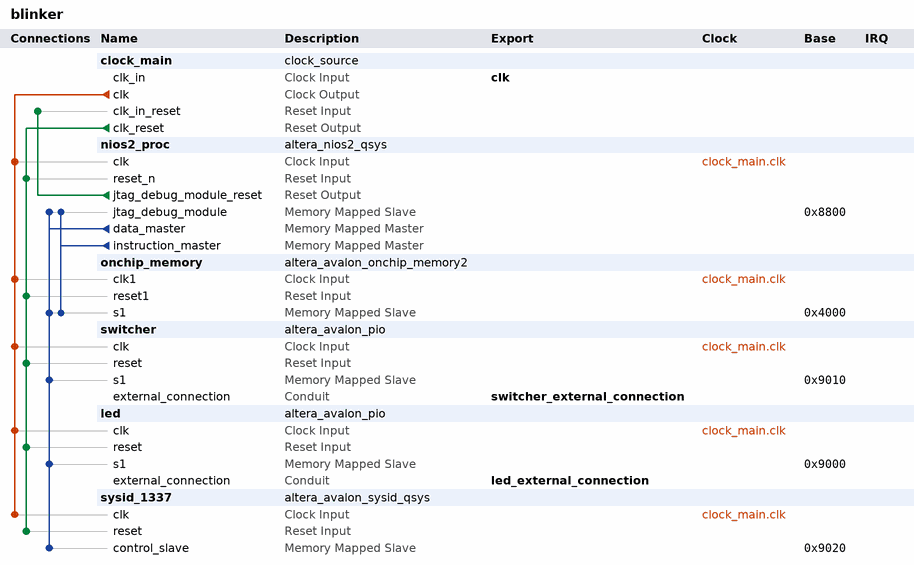
[diagram p0: system contents]
# Platform Designer (Qsys) system blinker, Cyclone IV GX Unknown
# Parameters at their usual value, and those the tool derives, are not listed.
package require -exact qsys 13.0
create_system blinker
set_project_property DEVICE_FAMILY {Cyclone IV GX}
set_project_property DEVICE Unknown

add_instance clock_main clock_source 13.0
set_instance_parameter_value clock_main clockFrequency 50000000

add_instance nios2_proc altera_nios2_qsys 13.0
set_instance_parameter_value nios2_proc resetSlave onchip_memory.s1
set_instance_parameter_value nios2_proc mmu_TLBMissExcSlave None
set_instance_parameter_value nios2_proc exceptionSlave onchip_memory.s1
set_instance_parameter_value nios2_proc breakSlave nios2_proc.jtag_debug_module
set_instance_parameter_value nios2_proc impl Tiny
set_instance_parameter_value nios2_proc icache_size 4096

add_instance onchip_memory altera_avalon_onchip_memory2 13.0.1.99.2
set_instance_parameter_value onchip_memory dataWidth 32
set_instance_parameter_value onchip_memory dualPort false
set_instance_parameter_value onchip_memory initMemContent true
set_instance_parameter_value onchip_memory initializationFileName onchip_mem.hex
set_instance_parameter_value onchip_memory memorySize 16384

add_instance switcher altera_avalon_pio 13.0.1.99.2
set_instance_parameter_value switcher direction Input
set_instance_parameter_value switcher width 8

add_instance led altera_avalon_pio 13.0.1.99.2
set_instance_parameter_value led direction Output
set_instance_parameter_value led width 8

add_instance sysid_1337 altera_avalon_sysid_qsys 13.0
set_instance_parameter_value sysid_1337 id 4919

# connections
add_connection clock_main.clk led.clk clock
add_connection clock_main.clk nios2_proc.clk clock
add_connection clock_main.clk onchip_memory.clk1 clock
add_connection clock_main.clk switcher.clk clock
add_connection clock_main.clk sysid_1337.clk clock
add_connection clock_main.clk_reset led.reset reset
add_connection clock_main.clk_reset nios2_proc.reset_n reset
add_connection clock_main.clk_reset onchip_memory.reset1 reset
add_connection clock_main.clk_reset switcher.reset reset
add_connection clock_main.clk_reset sysid_1337.reset reset
add_connection nios2_proc.jtag_debug_module_reset clock_main.clk_in_reset reset
add_connection nios2_proc.data_master led.s1 avalon
set_connection_parameter_value nios2_proc.data_master/led.s1 baseAddress 0x9000
add_connection nios2_proc.data_master nios2_proc.jtag_debug_module avalon
set_connection_parameter_value nios2_proc.data_master/nios2_proc.jtag_debug_module baseAddress 0x8800
add_connection nios2_proc.data_master onchip_memory.s1 avalon
set_connection_parameter_value nios2_proc.data_master/onchip_memory.s1 baseAddress 0x4000
add_connection nios2_proc.data_master switcher.s1 avalon
set_connection_parameter_value nios2_proc.data_master/switcher.s1 baseAddress 0x9010
add_connection nios2_proc.data_master sysid_1337.control_slave avalon
set_connection_parameter_value nios2_proc.data_master/sysid_1337.control_slave baseAddress 0x9020
add_connection nios2_proc.instruction_master nios2_proc.jtag_debug_module avalon
set_connection_parameter_value nios2_proc.instruction_master/nios2_proc.jtag_debug_module baseAddress 0x8800
add_connection nios2_proc.instruction_master onchip_memory.s1 avalon
set_connection_parameter_value nios2_proc.instruction_master/onchip_memory.s1 baseAddress 0x4000

# exported interfaces
add_interface clk clock sink
set_interface_property clk EXPORT_OF clock_main.clk_in
add_interface switcher_external_connection conduit end
set_interface_property switcher_external_connection EXPORT_OF switcher.external_connection
add_interface led_external_connection conduit end
set_interface_property led_external_connection EXPORT_OF led.external_connection

set_interconnect_requirement {$system} qsys_mm.clockCrossingAdapter HANDSHAKE
set_interconnect_requirement {$system} qsys_mm.maxAdditionalLatency 1

save_system blinker.qsys
